# EAGLE design powerboard1_1 (EAGLE 8.1.0)
DRAWING_TITLE: POWER_BOARD; REVISION: 1.1
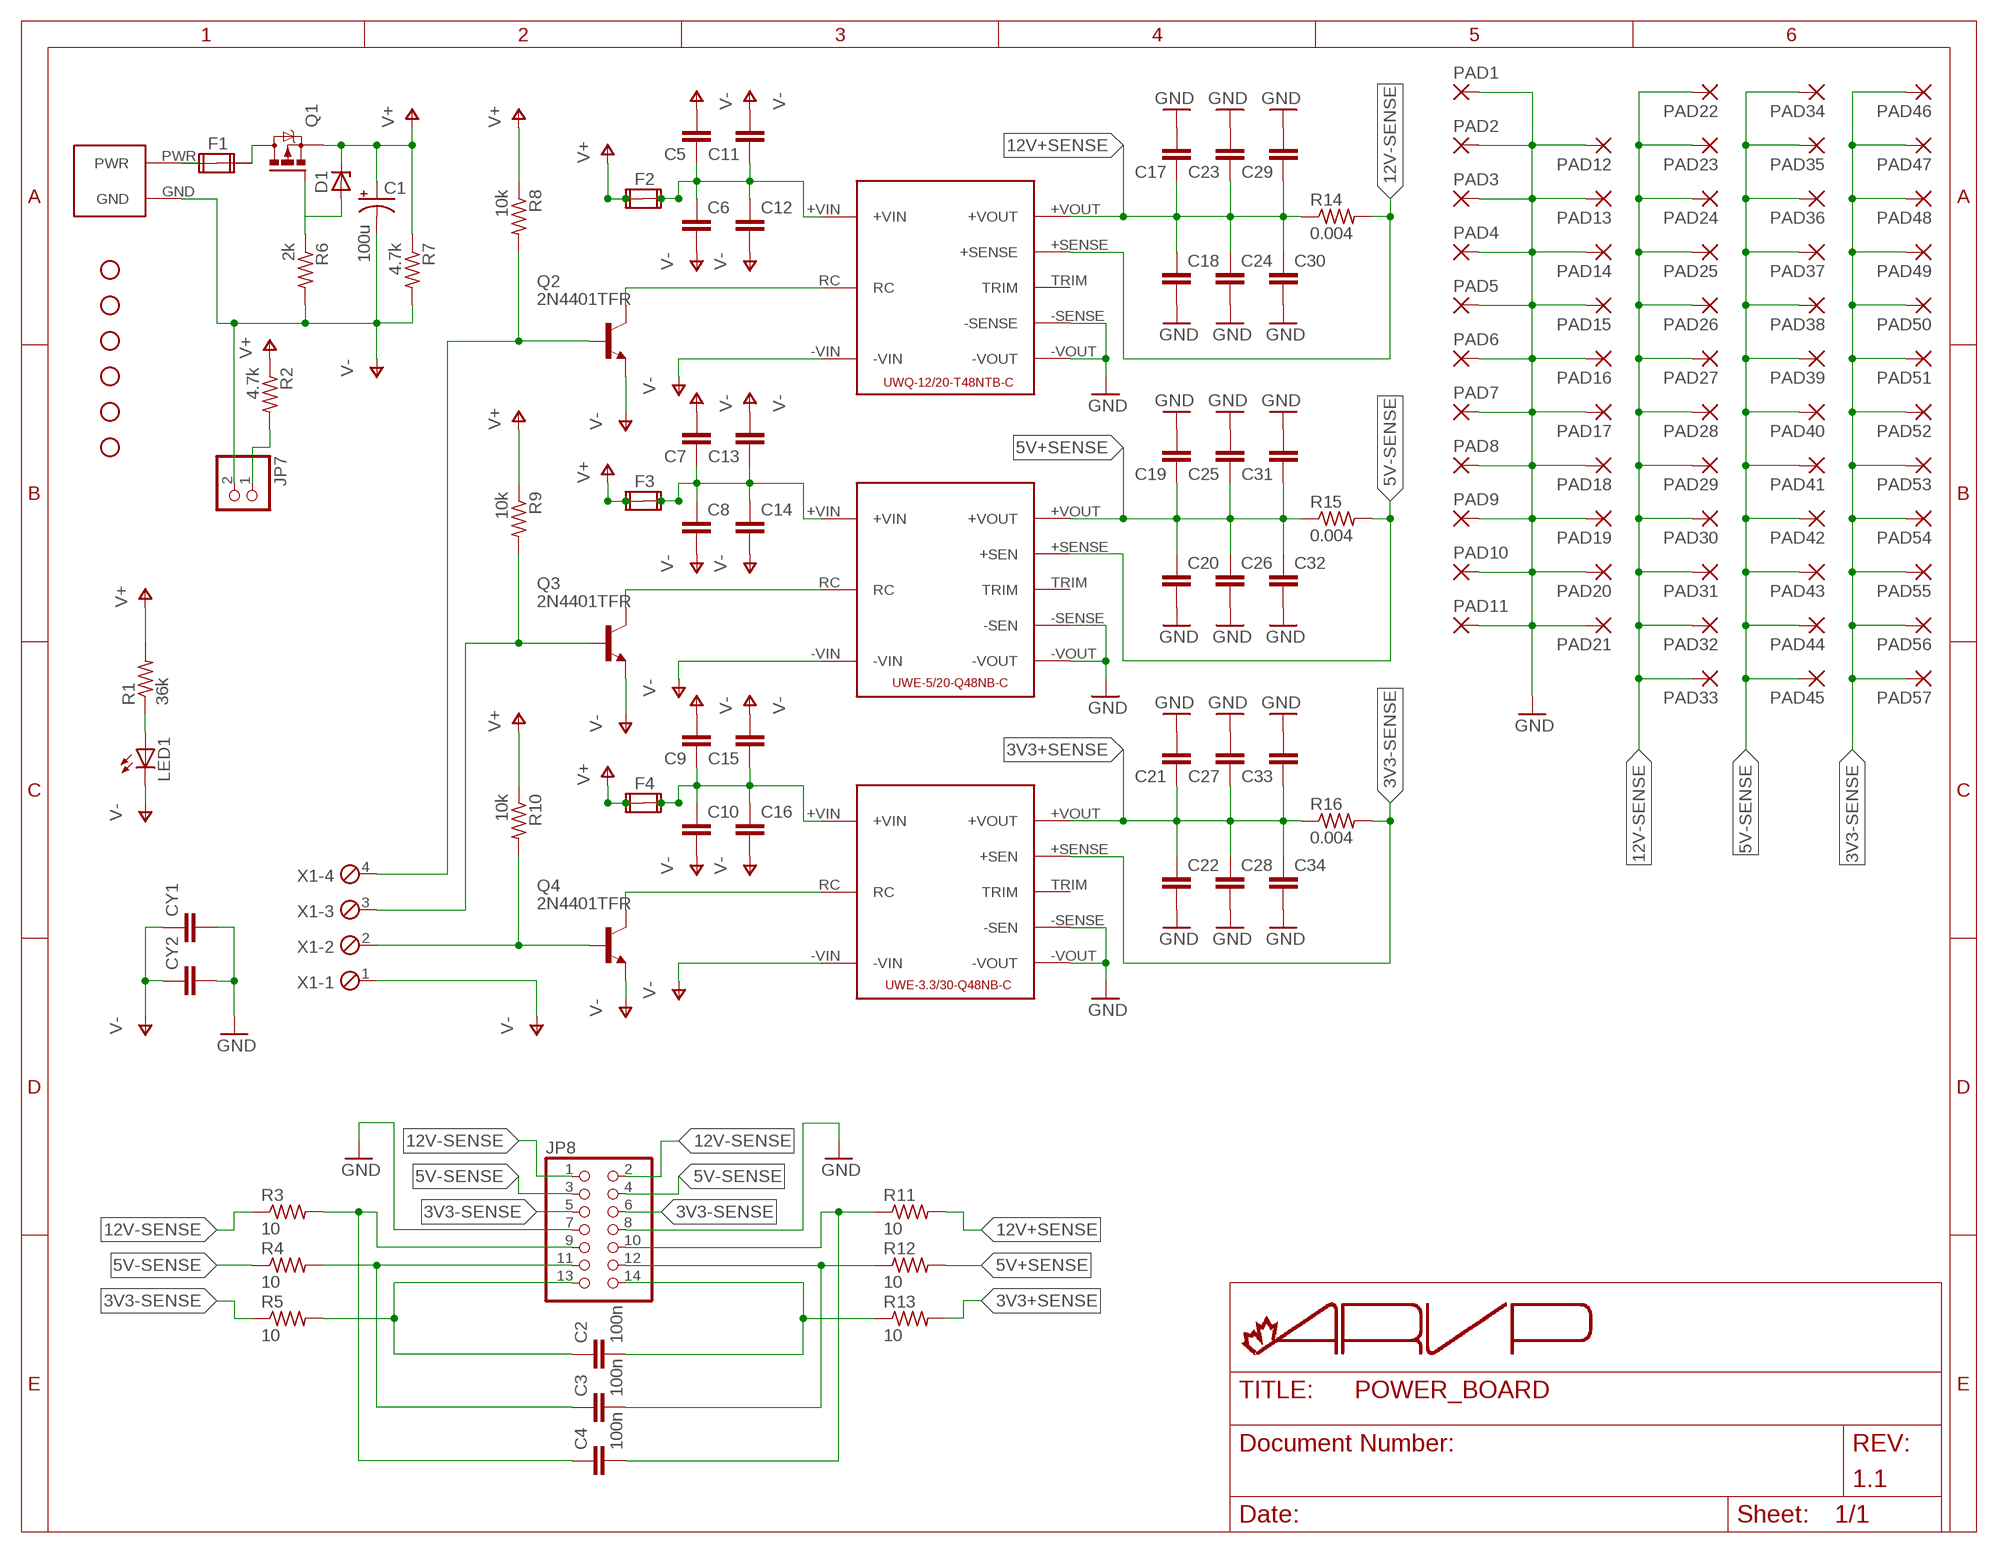
[diagram p0: schematic, sheet 1]

## Parts
C1  100u  CPOL-USE3.5-8  [E3,5-8]
C2  100n  C-EU025-024X044  [C025-024X044]
C3  100n  C-EU025-024X044  [C025-024X044]
C4  100n  C-EU025-024X044  [C025-024X044]
C5  C-EU050-035X075  [C050-035X075]
C6  C-EU050-035X075  [C050-035X075]
C7  C-EU050-035X075  [C050-035X075]
C8  C-EU050-035X075  [C050-035X075]
C9  C-EU050-035X075  [C050-035X075]
C10  C-EU050-035X075  [C050-035X075]
C11  C-EU050-035X075  [C050-035X075]
C12  C-EU050-035X075  [C050-035X075]
C13  C-EU050-035X075  [C050-035X075]
C14  C-EU050-035X075  [C050-035X075]
C15  C-EU050-035X075  [C050-035X075]
C16  C-EU050-035X075  [C050-035X075]
C17  C-EU025-040X050  [C025-040X050]
C18  C-EU025-040X050  [C025-040X050]
C19  C-EU025-040X050  [C025-040X050]
C20  C-EU025-040X050  [C025-040X050]
C21  C-EU025-040X050  [C025-040X050]
C22  C-EU025-040X050  [C025-040X050]
C23  C-EU025-040X050  [C025-040X050]
C24  C-EU025-040X050  [C025-040X050]
C25  C-EU025-040X050  [C025-040X050]
C26  C-EU025-040X050  [C025-040X050]
C27  C-EU025-040X050  [C025-040X050]
C28  C-EU025-040X050  [C025-040X050]
C29  C-EU025-040X050  [C025-040X050]
C30  C-EU025-040X050  [C025-040X050]
C31  C-EU025-040X050  [C025-040X050]
C32  C-EU025-040X050  [C025-040X050]
C33  C-EU025-040X050  [C025-040X050]
C34  C-EU025-040X050  [C025-040X050]
CY1  CYYC7B5  [YC7B5]
CY2  CYYC7B5  [YC7B5]
D1  BZV10  [DO34Z7]
F1  FUSE2P  [FUSE1]
F2  FUSE2P  [FUSE1]
F3  FUSE2P  [FUSE1]
F4  FUSE2P  [FUSE1]
JP1  STAND-OFF  [STAND-OFF]
JP2  STAND-OFF  [STAND-OFF]
JP3  STAND-OFF  [STAND-OFF]
JP4  STAND-OFF  [STAND-OFF]
JP5  STAND-OFF  [STAND-OFF]
JP6  STAND-OFF  [STAND-OFF]
JP7  PINHD-1X2  [1X02]
JP8  PINHD-2X7  [2X07]
LED1  LED3MM  [LED3MM]
P$1  AND_PWR  [AND_PWR]
PAD1  WIREPAD3,17/1,3  [3,17/1,3]
PAD2  WIREPAD3,17/1,3  [3,17/1,3]
PAD3  WIREPAD3,17/1,3  [3,17/1,3]
PAD4  WIREPAD3,17/1,3  [3,17/1,3]
PAD5  WIREPAD3,17/1,3  [3,17/1,3]
PAD6  WIREPAD3,17/1,3  [3,17/1,3]
PAD7  WIREPAD3,17/1,3  [3,17/1,3]
PAD8  WIREPAD3,17/1,3  [3,17/1,3]
PAD9  WIREPAD3,17/1,3  [3,17/1,3]
PAD10  WIREPAD3,17/1,3  [3,17/1,3]
PAD11  WIREPAD3,17/1,3  [3,17/1,3]
PAD12  WIREPAD3,17/1,3  [3,17/1,3]
PAD13  WIREPAD3,17/1,3  [3,17/1,3]
PAD14  WIREPAD3,17/1,3  [3,17/1,3]
PAD15  WIREPAD3,17/1,3  [3,17/1,3]
PAD16  WIREPAD3,17/1,3  [3,17/1,3]
PAD17  WIREPAD3,17/1,3  [3,17/1,3]
PAD18  WIREPAD3,17/1,3  [3,17/1,3]
PAD19  WIREPAD3,17/1,3  [3,17/1,3]
PAD20  WIREPAD3,17/1,3  [3,17/1,3]
PAD21  WIREPAD3,17/1,3  [3,17/1,3]
PAD22  WIREPAD3,17/1,3  [3,17/1,3]
PAD23  WIREPAD3,17/1,3  [3,17/1,3]
PAD24  WIREPAD3,17/1,3  [3,17/1,3]
PAD25  WIREPAD3,17/1,3  [3,17/1,3]
PAD26  WIREPAD3,17/1,3  [3,17/1,3]
PAD27  WIREPAD3,17/1,3  [3,17/1,3]
PAD28  WIREPAD3,17/1,3  [3,17/1,3]
PAD29  WIREPAD3,17/1,3  [3,17/1,3]
PAD30  WIREPAD3,17/1,3  [3,17/1,3]
PAD31  WIREPAD3,17/1,3  [3,17/1,3]
PAD32  WIREPAD3,17/1,3  [3,17/1,3]
PAD33  WIREPAD3,17/1,3  [3,17/1,3]
PAD34  WIREPAD3,17/1,3  [3,17/1,3]
PAD35  WIREPAD3,17/1,3  [3,17/1,3]
PAD36  WIREPAD3,17/1,3  [3,17/1,3]
PAD37  WIREPAD3,17/1,3  [3,17/1,3]
PAD38  WIREPAD3,17/1,3  [3,17/1,3]
PAD39  WIREPAD3,17/1,3  [3,17/1,3]
PAD40  WIREPAD3,17/1,3  [3,17/1,3]
PAD41  WIREPAD3,17/1,3  [3,17/1,3]
PAD42  WIREPAD3,17/1,3  [3,17/1,3]
PAD43  WIREPAD3,17/1,3  [3,17/1,3]
PAD44  WIREPAD3,17/1,3  [3,17/1,3]
PAD45  WIREPAD3,17/1,3  [3,17/1,3]
PAD46  WIREPAD3,17/1,3  [3,17/1,3]
PAD47  WIREPAD3,17/1,3  [3,17/1,3]
PAD48  WIREPAD3,17/1,3  [3,17/1,3]
PAD49  WIREPAD3,17/1,3  [3,17/1,3]
PAD50  WIREPAD3,17/1,3  [3,17/1,3]
PAD51  WIREPAD3,17/1,3  [3,17/1,3]
PAD52  WIREPAD3,17/1,3  [3,17/1,3]
PAD53  WIREPAD3,17/1,3  [3,17/1,3]
PAD54  WIREPAD3,17/1,3  [3,17/1,3]
PAD55  WIREPAD3,17/1,3  [3,17/1,3]
PAD56  WIREPAD3,17/1,3  [3,17/1,3]
PAD57  WIREPAD3,17/1,3  [3,17/1,3]
Q1  IPP80P03P4L04AKSA1  [TO220BV]
Q2  2N4401TFR  [TO92-EBC]
Q3  2N4401TFR  [TO92-EBC]
Q4  2N4401TFR  [TO92-EBC]
R1  36k  R-US_0204/7  [0204/7]
R2  4.7k  R-US_0204/7  [0204/7]
R3  10  R-US_0204/5  [0204/5]
R4  10  R-US_0204/5  [0204/5]
R5  10  R-US_0204/5  [0204/5]
R6  2k  R-US_0204/7  [0204/7]
R7  4.7k  R-US_0204/7  [0204/7]
R8  10k  R-US_0204/7  [0204/7]
R9  10k  R-US_0204/7  [0204/7]
R10  10k  R-US_0204/7  [0204/7]
R11  10  R-US_0204/5  [0204/5]
R12  10  R-US_0204/5  [0204/5]
R13  10  R-US_0204/5  [0204/5]
R14  0.004  R-US_0617/22  [0617/22]
R15  0.004  R-US_0617/22  [0617/22]
R16  0.004  R-US_0617/22  [0617/22]
U1  UWQ-12/20-T48NTB-C  [UWQ-12/20-T48]
U2  UWE-5/20-Q48NB-C  [UWE-100-120W]
U3  UWE-3.3/30-Q48NB-C  [UWE-100-120W]
X1  MPT4  [4POL254]

## Nets
3V3+SENSE: C21.1 C22.1 C27.1 C28.1 C33.1 C34.1 R13.2 R16.1 U3.+VOUT
3V3-SENSE: JP8.5 JP8.6 PAD46.1(P) PAD47.1(P) PAD48.1(P) PAD49.1(P) PAD50.1(P) PAD51.1(P) PAD52.1(P) PAD53.1(P) PAD54.1(P) PAD55.1(P) PAD56.1(P) PAD57.1(P) R5.1 R16.2 U3.+SENSE(+SEN)
5V+SENSE: C19.1 C20.1 C25.1 C26.1 C31.1 C32.1 R12.2 R15.1 U2.+VOUT
5V-SENSE: JP8.3 JP8.4 PAD34.1(P) PAD35.1(P) PAD36.1(P) PAD37.1(P) PAD38.1(P) PAD39.1(P) PAD40.1(P) PAD41.1(P) PAD42.1(P) PAD43.1(P) PAD44.1(P) PAD45.1(P) R4.1 R15.2 U2.+SENSE(+SEN)
12V+SENSE: C17.1 C18.1 C23.1 C24.1 C29.1 C30.1 R11.2 R14.1 U1.+VOUT
12V-SENSE: JP8.1 JP8.2 PAD22.1(P) PAD23.1(P) PAD24.1(P) PAD25.1(P) PAD26.1(P) PAD27.1(P) PAD28.1(P) PAD29.1(P) PAD30.1(P) PAD31.1(P) PAD32.1(P) PAD33.1(P) R3.1 R14.2 U1.+SENSE
GND [ouputGroundPlane]: C17.2 C18.2 C19.2 C20.2 C21.2 C22.2 C23.2 C24.2 C25.2 C26.2 C27.2 C28.2 C29.2 C30.2 C31.2 C32.2 C33.2 C34.2 CY1.2 CY2.2 JP8.7 JP8.8 PAD1.1(P) PAD2.1(P) PAD3.1(P) PAD4.1(P) PAD5.1(P) PAD6.1(P) PAD7.1(P) PAD8.1(P) PAD9.1(P) PAD10.1(P) PAD11.1(P) PAD12.1(P) PAD13.1(P) PAD14.1(P) PAD15.1(P) PAD16.1(P) PAD17.1(P) PAD18.1(P) PAD19.1(P) PAD20.1(P) PAD21.1(P) U1.-SENSE U1.-VOUT U2.-SENSE(-SEN) U2.-VOUT U3.-SENSE(-SEN) U3.-VOUT
J3: C4.1 JP8.9 R3.2
J4: C4.2 JP8.10 R11.1
J5: C3.1 JP8.11 R4.2
J6: C3.2 JP8.12 R12.1
J7: C2.1 JP8.13 R5.2
J8: C2.2 JP8.14 R13.1
N$1: LED1.A R1.1
N$2: JP7.1 R2.2
N$3: F1.1A F1.1B P$1.PWR
N$4: D1.A Q1.G R6.1
N$5: C5.1 C6.1 C11.1 C12.1 F2.2A F2.2B U1.+VIN
N$7: C7.1 C8.1 C13.1 C14.1 F3.2A F3.2B U2.+VIN
N$8: Q2.C U1.RC
N$10: Q3.C U2.RC
N$11: Q4.C U3.RC
N$12: C9.1 C10.1 C15.1 C16.1 F4.2A F4.2B U3.+VIN
ON/OFF_1 [inputGroundPlane]: Q2.B R8.2 X1.4
ON/OFF_2 [inputGroundPlane]: Q3.B R9.2 X1.3
ON/OFF_3 [inputGroundPlane]: Q4.B R10.2 X1.2
V+: C1.+ D1.C F2.1A F2.1B F3.1A F3.1B F4.1A F4.1B Q1.S R1.2 R2.1 R7.1 R8.1 R9.1 R10.1
V- [ouputGroundPlane]: C1.- C5.2 C6.2 C7.2 C8.2 C9.2 C10.2 C11.2 C12.2 C13.2 C14.2 C15.2 C16.2 CY1.1 CY2.1 JP7.2 LED1.K(C) P$1.GND Q2.E Q3.E Q4.E R6.2 R7.2 U1.-VIN U2.-VIN U3.-VIN X1.1
VBAT+: F1.2A F1.2B Q1.D
Unconnected: U1.TRIM U2.TRIM U3.TRIM

## Library data of the parts
C1 = rcl:CPOL-US: POLARIZED CAPACITOR, American symbol
C2-C34 = rcl:C-EU: CAPACITOR, European symbol
CY1 CY2 = rcl:CY: Y CAPACITOR for power line
D1 = diode:BZV10: Z DIODE
F1-F4 = special:FUSE2P: FUSE 5 x 20 mm
JP1-JP6 = SparkFun:STAND-OFF: Stand Off This is the mechanical footprint for a #4 phillips button head screw. Use the keepout ring to avoid running the screw head into surrounding components. SKU : PRT-00447
JP7 = pinhead:PINHD-1X2: PIN HEADER
JP8 = pinhead:PINHD-2X7: PIN HEADER
LED1 = led:LED: LED OSRAM: - CHIPLED LG R971, LG N971, LY N971, LG Q971, LY Q971, LO R971, LY R971 LH N974, LH R974 LS Q976, LO Q976, LY Q976 LO Q996 - Hyper CHIPLED LW Q18S LB Q993, LB Q99A, LB R99A - SideLED LS A670, LO A670, LY A670, LG A670, LP A670 LB A673, LV A673, LT A673, LW A673 LH A674 LY A675 LS A676, LA A676, LO A676, LY A676, LW A676 LS A679, LY A679, LG A679 - Hyper Micro SIDELED® LS Y876, LA Y876, LO Y876, LY Y876 LT Y87S - SmartLED LW L88C, LW L88S LB L89C, LB L89S, LG L890 LS L89K, LO L89K, LY L89K LS L896, LA L896, LO L896, LY L896 - TOPLED LS T670, LO T670, LY T670, LG T670, LP T670 LSG T670, LSP T670, LSY T670, LOP T670, LYG T670 LG T671, LOG T671, LSG T671 LB T673, LV T673, LT T673, LW T673 LH T674 LS T676, LA T676, LO T676, LY T676, LB T676, LH T676, LSB T676, LW T676 LB T67C, LV T67C, LT T67C, LS T67K, LO T67K, LY T67K, LW E67C LS E67B, LA E67B, LO E67B, LY E67B, LB E67C, LV E67C, LT E67C LW T67C LS T679, LY T679, LG T679 LS T770, LO T770, LY T770, LG T770, LP T770 LB T773, LV T773, LT T773, LW T773 LH T774 LS E675, LA E675, LY E675, LS T675 LS T776, LA T776, LO T776, LY T776, LB T776 LHGB T686 LT T68C, LB T68C - Hyper Mini TOPLED® LB M676 - Mini TOPLED Santana® LG M470 LS M47K, LO M47K, LY M47K Source: http://www.osram.convergy.de LUXEON: - LUMILED® LXK2-PW12-R00, LXK2-PW12-S00, LXK2-PW14-U00, LXK2-PW14-V00 LXK2-PM12-R00, LXK2-PM12-S00, LXK2-PM14-U00 LXK2-PE12-Q00, LXK2-PE12-R00, LXK2-PE12-S00, LXK2-PE14-T00, LXK2-PE14-U00 LXK2-PB12-K00, LXK2-PB12-L00, LXK2-PB12-M00, LXK2-PB14-N00, LXK2-PB14-P00, LXK2-PB14-Q00 LXK2-PR12-L00, LXK2-PR12-M00, LXK2-PR14-Q00, LXK2-PR14-R00 LXK2-PD12-Q00, LXK2-PD12-R00, LXK2-PD12-S00 LXK2-PH12-R00, LXK2-PH12-S00 LXK2-PL12-P00, LXK2-PL12-Q00, LXK2-PL12-R00 Source: www.luxeon.com KINGBRIGHT: KA-3528ASYC Source: www.kingbright.com
P$1 = ARVP:AND_PWR
PAD1-PAD57 = wirepad:WIREPAD: Wire PAD connect wire on PCB
Q1 = transistor-power:IPP80P03P4L04AKSA1: P-CHANNEL MOS-FET SYMBOL
Q2-Q4 = New Power Board Library:2N4401TFR: NPN Transistor
R1 R2 R6-R10 = resistor:R-US_: RESISTOR, American symbol
R3-R5 R11-R16 = rcl:R-US_: RESISTOR, American symbol
U1 = New Power Board Library:UWQ-12/20-T48NTB-C
U2 = New Power Board Library:UWE-5/20-Q48NB-C
U3 = New Power Board Library:UWE-3.3/30-Q48NB-C
X1 = con-phoenix-254:MPT4: PHOENIX CONNECTOR; OC_FARNELL: unknown; OC_NEWARK: unknown

## Net classes
0 default: clearance 0.205 mm
1 ouputGroundPlane: clearance 0.205 mm to class 0, clearance 1 mm
2 inputGroundPlane: clearance 0.205 mm to class 1

## Board
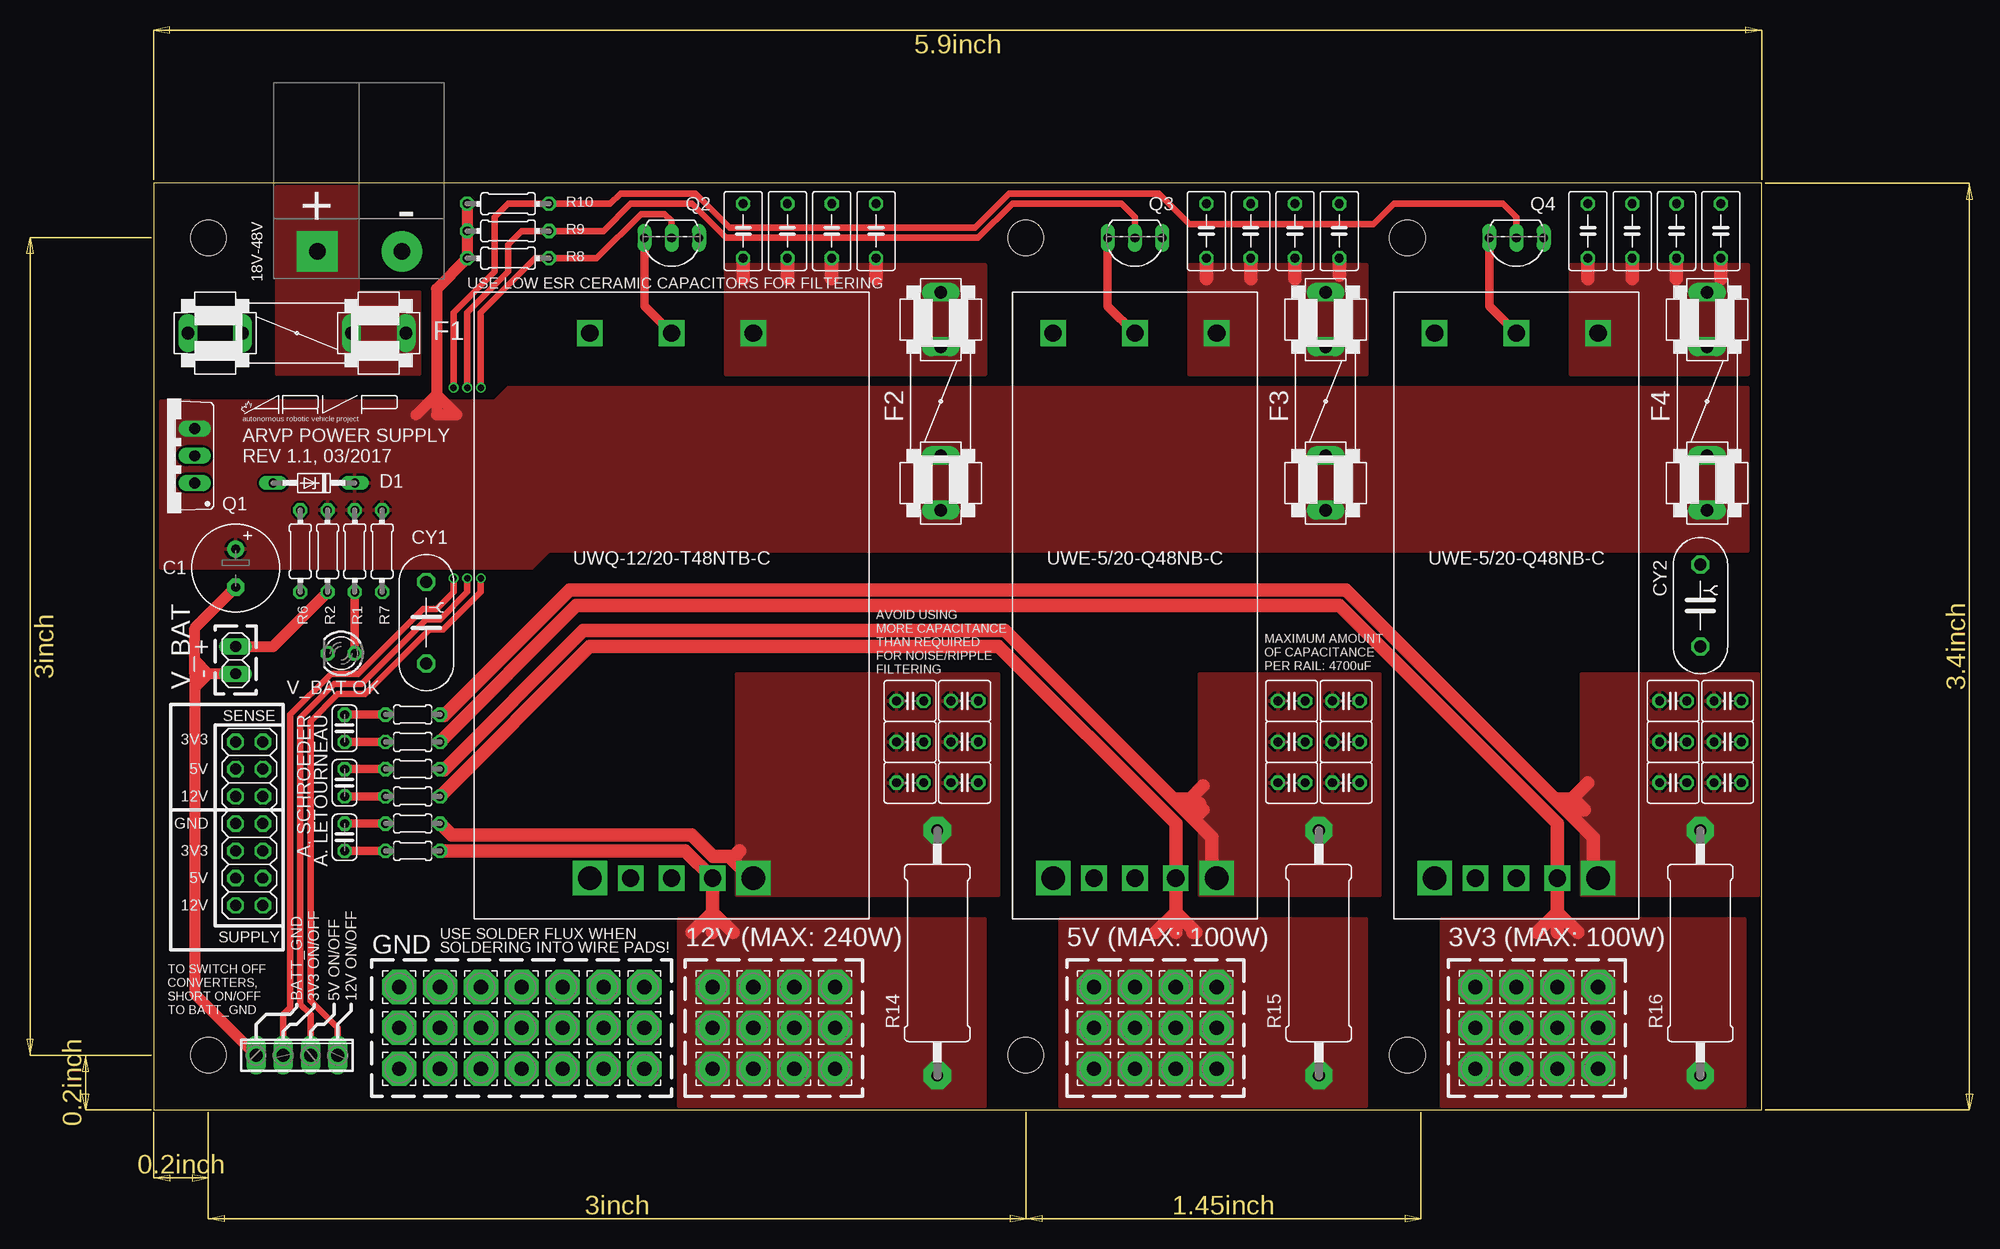
[diagram p1: board, top side]
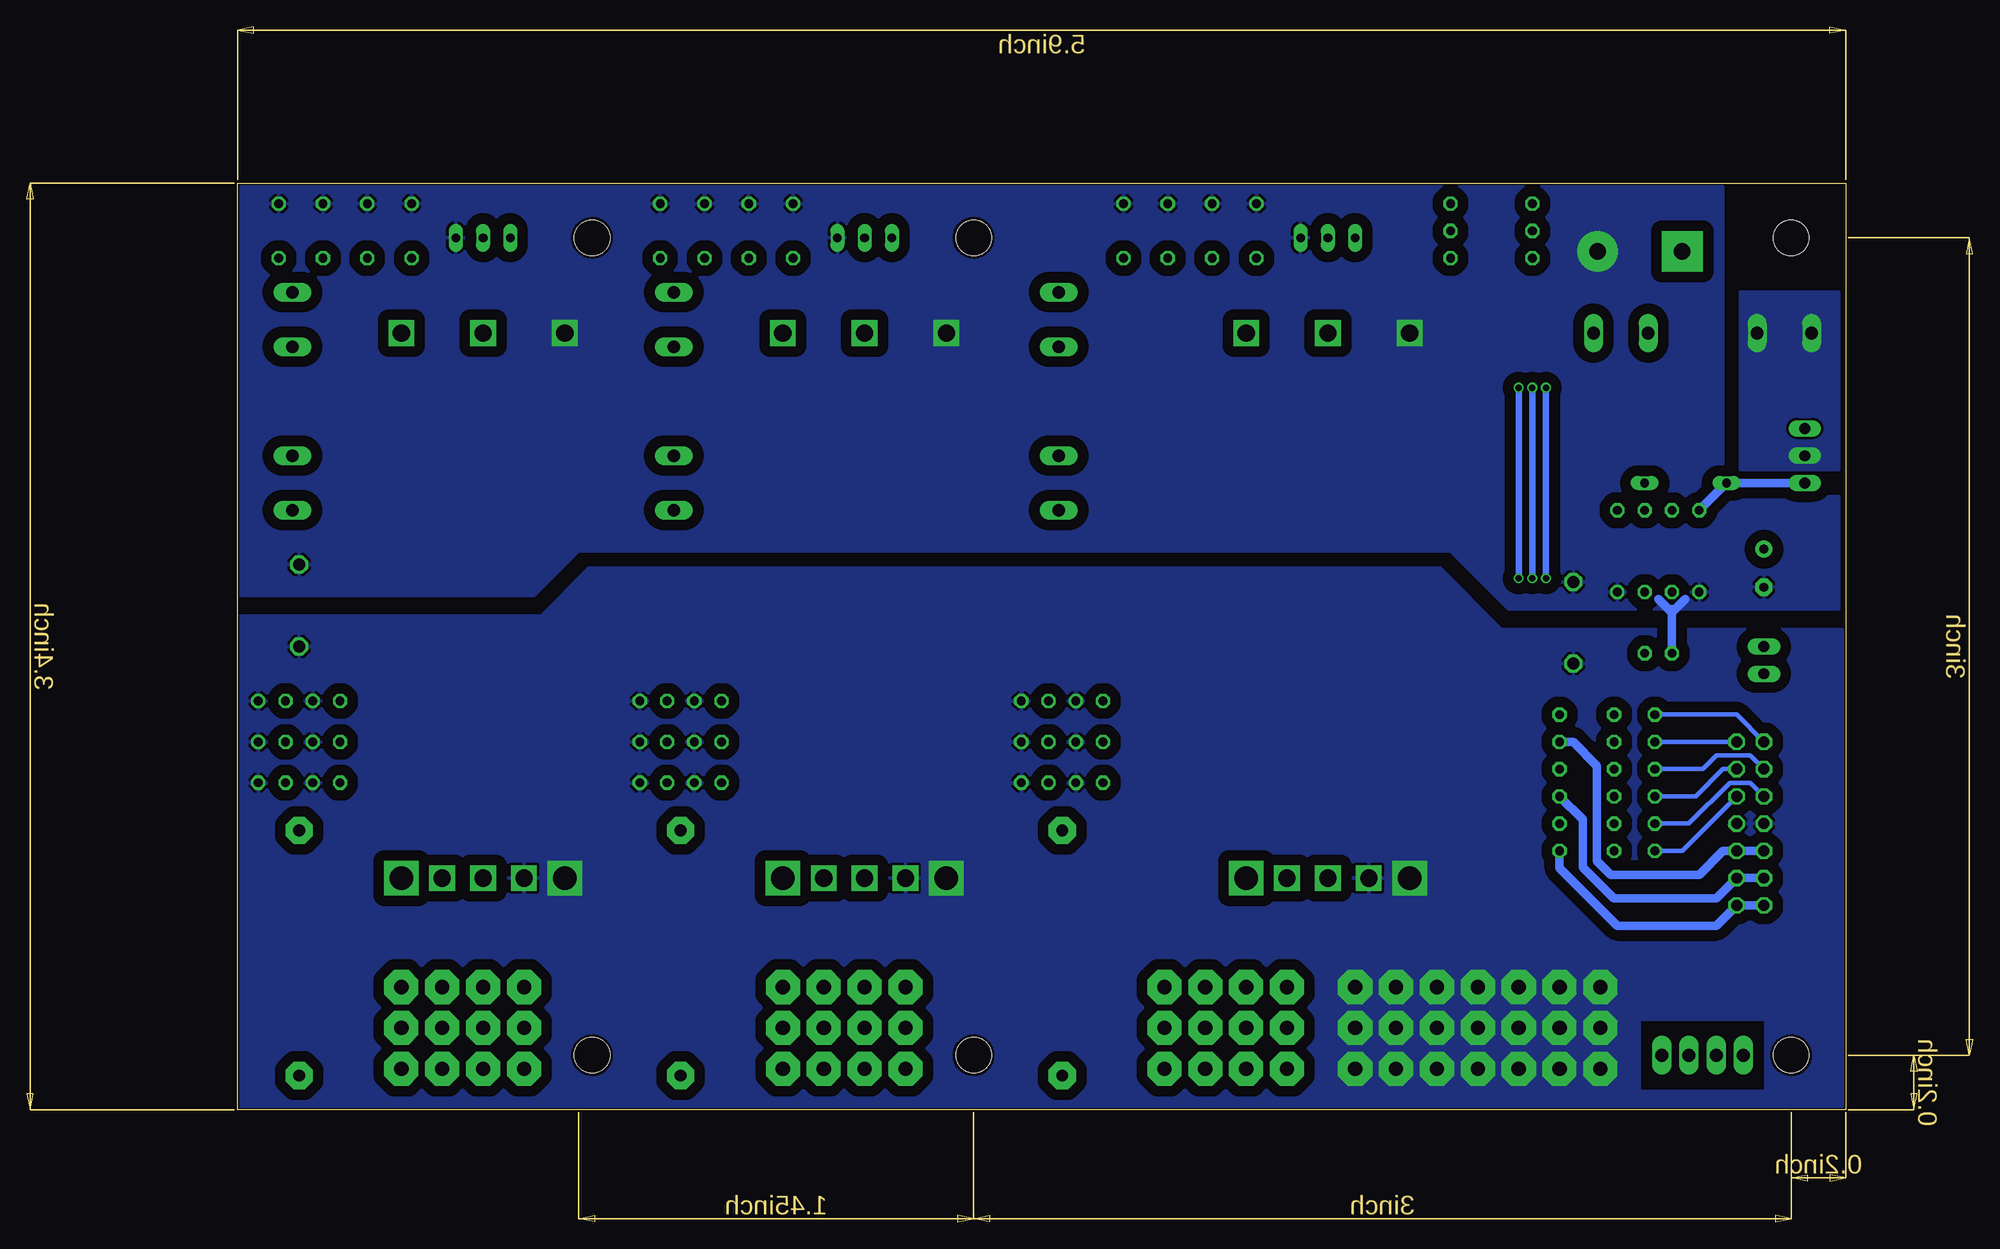
[diagram p2: board, bottom side, seen from below]

Size 181.36 x 111.41 mm. Coordinates in mm from the lower left corner, seen from the top.
Copper layers (1*16): Top 0.035mm / dielectric 1.5mm / Bottom 0.035mm
Design rules "ITEADstudioDRC": minimum track width 6mil, minimum drill 12mil, track to track 6mil, track to pad 6mil, pad to pad 6mil, via to via 6mil, smd to smd 0mil, copper to edge 10mil, drill to drill 10mil, minimum pad ring 10mil, minimum via ring 6mil, stop-mask expansion 2mil, vias tented up to drill 100mil, thermal gap 10mil
Milling: 4 lines

### Footprints (pad centres in the part's own frame; a part is rotated, then mirrored left to right if it is on the bottom)
E3,5-8 = drill 0.813 pad 1.6: + -1.778,0 | drill 0.813 pad 1.6 octagon: - 1.778,0
C025-024X044 = drill 0.813 octagon: 1 -1.27,0; 2 1.27,0
C050-035X075 = drill 0.813 octagon: 1 -2.54,0; 2 2.54,0
C025-040X050 = drill 0.813 octagon: 1 -1.27,0; 2 1.27,0
YC7B5 = drill 1.118 octagon: 1 -3.81,0; 2 3.81,0
DO34Z7 = drill 0.813 long: A 3.81,0; C -3.81,0
FUSE1 = drill 1.194 long: 1A -10.16,0; 1B -5.08,0; 2A 10.16,0; 2B 5.08,0
STAND-OFF = hole 3.302: 0,0
1X02 = drill 1.016 long: 1 -1.27,0; 2 1.27,0
2X07 = drill 1.016 octagon: 1 -7.62,-1.27; 2 -7.62,1.27; 3 -5.08,-1.27; 4 -5.08,1.27; 5 -2.54,-1.27; 6 -2.54,1.27; 7 0,-1.27; 8 0,1.27; 9 2.54,-1.27; 10 2.54,1.27; 11 5.08,-1.27; 12 5.08,1.27; 13 7.62,-1.27; 14 7.62,1.27
LED3MM = drill 0.813 octagon: A -1.27,0; K 1.27,0
AND_PWR = drill 1.524 pad 3.81: GND 0,-7.886 | drill 1.524 pad 3.81 square: PWR 0,0
3,17/1,3 = drill 1.321 pad 3.175 octagon: 1 0,0
TO220BV = drill 1.016 long: D 0,-2.54; G -2.54,-2.54; S 2.54,-2.54
TO92-EBC = drill 0.813 long: B 0,-1.27; C 2.54,-1.27; E -2.54,-1.27
0204/7 = drill 0.813 octagon: 1 -3.81,0; 2 3.81,0
0204/5 = drill 0.813 octagon: 1 -2.54,0; 2 2.54,0
0617/22 = drill 1.1 pad 2.54 octagon: 1 -11.43,0; 2 11.43,0
UWQ-12/20-T48 = drill 1.6 square: +SENSE 25.4,3.81; +VIN -25.4,7.62; -SENSE 25.4,-3.81; -VIN -25.4,-7.62; RC -25.4,0; TRIM 25.4,0 | drill 2.2 square: +VOUT 25.4,7.62; -VOUT 25.4,-7.62
UWE-100-120W = drill 1.6 square: +SENSE 25.4,3.81; +VIN -25.4,7.62; -SENSE 25.4,-3.81; -VIN -25.4,-7.62; RC -25.4,0; TRIM 25.4,0 | drill 2.2 square: +VOUT 25.4,7.62; -VOUT 25.4,-7.62
4POL254 = drill 1.2 long: 1 -3.81,0; 2 -1.27,0; 3 1.27,0; 4 3.81,0

### Placement (x,y rotation side)
C1  19.46,60.94 270 top
C2  29.62,46.02 90 top
C3  29.62,40.94 90 top
C4  29.62,35.86 90 top
C5  79.15,92.38 90 top
C6  66.76,92.38 90 top
C7  122.33,92.38 90 top
C8  109.94,92.38 90 top
C9  157.89,92.38 90 top
C10  145.5,92.38 90 top
C11  75.02,92.38 90 top
C12  70.89,92.38 90 top
C13  118.2,92.38 90 top
C14  114.07,92.38 90 top
C15  153.76,92.38 90 top
C16  149.63,92.38 90 top
C17  87.4,40.94 0 top
C18  82.32,48.56 0 top
C19  122.96,40.94 0 top
C20  117.88,44.75 0 top
C21  158.52,40.94 0 top
C22  153.44,48.56 0 top
C23  87.4,44.75 0 top
C24  82.32,44.75 0 top
C25  122.96,44.75 0 top
C26  117.88,48.56 0 top
C27  158.52,44.75 0 top
C28  153.44,44.75 0 top
C29  87.4,48.56 0 top
C30  82.32,40.94 0 top
C31  122.96,48.56 0 top
C32  117.88,40.94 0 top
C33  158.52,48.56 0 top
C34  153.44,40.94 0 top
CY1  37.24,55.86 270 top
CY2  155.98,57.45 270 top
D1  26.76,68.88 180 top
F1  25.17,82.85 180 top
F2  85.18,76.5 90 top
F3  121.06,76.5 90 top
F4  156.62,76.5 90 top
JP1  93.12,15.54 0 top
JP2  128.68,15.54 0 top
JP3  128.68,91.74 0 top
JP4  16.92,15.54 0 top
JP5  16.92,91.74 0 top
JP6  93.12,91.74 0 top
JP7  19.46,52.37 270 top
JP8  20.73,37.13 90 top
LED1  29.3,53.01 180 top
P$1  27.08,90.47 90 top
PAD1  38.51,21.89 0 top
PAD2  42.32,21.89 0 top
PAD3  46.13,21.89 0 top
PAD4  49.94,21.89 0 top
PAD5  53.75,21.89 0 top
PAD6  57.56,21.89 0 top
PAD7  34.7,14.27 0 top
PAD8  38.51,18.08 0 top
PAD9  42.32,18.08 0 top
PAD10  46.13,18.08 0 top
PAD11  49.94,18.08 0 top
PAD12  34.7,18.08 0 top
PAD13  57.56,14.27 0 top
PAD14  53.75,14.27 0 top
PAD15  49.94,14.27 0 top
PAD16  46.13,14.27 0 top
PAD17  42.32,14.27 0 top
PAD18  38.51,14.27 0 top
PAD19  34.7,21.89 0 top
PAD20  57.56,18.08 0 top
PAD21  53.75,18.08 0 top
PAD22  71.53,21.89 0 top
PAD23  75.34,21.89 0 top
PAD24  75.34,14.27 0 top
PAD25  71.53,14.27 0 top
PAD26  67.72,14.27 0 top
PAD27  63.91,14.27 0 top
PAD28  75.34,18.08 0 top
PAD29  63.91,21.89 0 top
PAD30  67.72,21.89 0 top
PAD31  71.53,18.08 0 top
PAD32  67.72,18.08 0 top
PAD33  63.91,18.08 0 top
PAD34  110.9,14.27 0 top
PAD35  110.9,21.89 0 top
PAD36  107.09,21.89 0 top
PAD37  107.09,14.27 0 top
PAD38  103.28,14.27 0 top
PAD39  99.47,14.27 0 top
PAD40  110.9,18.08 0 top
PAD41  99.47,21.89 0 top
PAD42  103.28,21.89 0 top
PAD43  107.09,18.08 0 top
PAD44  103.28,18.08 0 top
PAD45  99.47,18.08 0 top
PAD46  146.46,21.89 0 top
PAD47  142.65,21.89 0 top
PAD48  146.46,14.27 0 top
PAD49  142.65,14.27 0 top
PAD50  138.84,14.27 0 top
PAD51  135.03,14.27 0 top
PAD52  138.84,21.89 0 top
PAD53  135.03,21.89 0 top
PAD54  146.46,18.08 0 top
PAD55  142.65,18.08 0 top
PAD56  138.84,18.08 0 top
PAD57  135.03,18.08 0 top
Q1  13.11,71.42 90 top
Q2  60.1,90.47 180 top
Q3  103.28,90.47 180 top
Q4  138.84,90.47 180 top
R1  30.57,62.53 90 top
R2  28.03,62.53 270 top
R3  35.97,34.59 180 top
R4  35.97,39.67 180 top
R5  35.97,44.75 180 top
R6  25.49,62.53 270 top
R7  33.11,62.53 270 top
R8  44.86,89.84 0 top
R9  44.86,92.38 0 top
R10  44.86,94.91 0 top
R11  35.97,37.13 0 top
R12  35.97,42.21 0 top
R13  35.97,47.29 0 top
R14  84.86,25.07 270 top
R15  120.42,25.07 270 top
R16  155.98,25.07 270 top
U1  60.1,57.45 270 top
U2  103.28,57.45 270 top
U3  138.84,57.45 270 top
U$1  [FRAME_A_L]  -55.47,-61.93 0 top  (outside the outline)
U$2  [DOCFIELD]  118.52,-61.93 0 top  (outside the outline)
U$3  [ARVP]  20.09,74.59 0 top
X1  25.17,15.54 0 top

### Tracks (layer width: path | path; a pad name or v marks a point on that pad's centre or on a via)
3V3+SENSE
  Top 1.27: U3.+VOUT 146.03,32.48 146.03,35.84 122.94,58.93 50.6,58.93 38.89,47.22 38.58,47.22 R13.2 | 145.5,40.94 144.01,39.44 142.42,39.44 144.14,39.44 145.19,38.4
  pour Top: 161.38,30.46 161.38,51.1 144.87,51.1 144.87,30.46
  pour Top (no thermals): 157.89,38.4 144.87,38.4 144.87,30.46 157.89,30.46
3V3-SENSE
  Top 1.27: 142.65,26.97 U3.+SENSE 142.65,37.13 122.33,57.45 51.21,57.45 R5.1 | 142.65,28.88 142.65,29.51 142.65,28.88 | 142.65,28.88 140.74,26.97 | 142.65,28.88 144.55,26.97
  Bottom 0.813: JP8.6 JP8.5 23.27,34.59 25.49,32.37 33.74,32.37 35.02,33.64 35.02,42.53 37.24,44.75 R5.1
  pour Top (no thermals): 131.85,28.24 160.11,28.24 160.11,10.78 131.85,10.78
5V+SENSE
  Top 1.27: U2.+VOUT 110.47,32.48 110.47,35.84 91.19,55.12 51.87,55.12 38.89,42.14 38.58,42.14 R12.2 | 109.63,38.4 109.4,38.17 108.13,38.17 108.45,38.17 109.31,39.03 | 106.86,39.44 108.45,39.44 109.63,40.62
  pour Top: 109.31,30.46 109.31,51.1 126.14,51.1 126.14,30.46
  pour Top (no thermals): 122.33,38.4 109.31,38.4 109.31,30.46 122.33,30.46
5V-SENSE
  Top 1.27: 107.09,26.97 U2.+SENSE 107.09,37.13 90.58,53.64 52.48,53.64 R4.1 | 107.09,28.88 107.09,29.51 107.09,28.88 | 107.09,28.88 108.99,26.97 108.67,26.97 | 107.09,28.88 105.18,26.97
  Bottom 0.813: JP8.4 JP8.3 23.9,30.15 33.43,30.15 36.35,33.07 36.35,37.51 R4.1
  pour Top (no thermals): 124.87,28.24 96.29,28.24 96.29,10.78 124.87,10.78
12V+SENSE
  Top 1.27: 65.46,34.09 63.95,34.09 61.98,36.06 39.57,36.06 R11.2 | U1.+VOUT 67.5,32.05 65.46,34.09 | 65.46,34.09 65.95,34.09 66.45,34.59
  pour Top: 66.13,30.46 90.58,30.46 90.58,51.1 66.13,51.1
  pour Top (no thermals): 86.77,38.4 66.13,38.4 66.13,30.46 86.77,30.46
12V-SENSE
  Top 1.27: 63.91,26.97 U1.+SENSE 61.37,34.59 R3.1 | 63.91,28.88 65.81,26.97 | 63.91,29.51 63.91,28.88 | 63.91,28.88 62,26.97
  Bottom 0.813: JP8.2 JP8.1 23.9,27.61 33.11,27.61 38.51,33 R3.1
  pour Top (no thermals): 89.31,28.24 60.73,28.24 60.73,10.78 89.31,10.78
GND
  pour Bottom: 161.38,56.5 161.38,10.78 12.15,10.78 12.15,55.23 43.9,55.23 49.62,60.94 128.99,60.94 133.44,56.5
  pour Bottom (no thermals): 49.94,34.59 49.94,29.51 54.7,29.51 54.7,34.59
  pour Bottom (no thermals): 93.12,34.59 93.12,29.51 97.88,29.51 97.88,34.59
  pour Bottom (no thermals): 128.68,34.59 128.68,29.51 133.44,29.51 133.44,34.59
  pour Bottom (no thermals): 32.16,24.43 32.16,11.73 61.37,11.73 61.37,24.43
  cutout Bottom: 19.46,18.71 30.89,18.71 30.89,12.37 19.46,12.37
J3
  Top 0.813: R3.2 C4.1
  Bottom 0.406: JP8.9 27.08,34.59 C4.1
J4
  Top 0.813: R11.1 C4.2
  Bottom 0.406: JP8.10 20.73,40.94 22.63,40.94 26.44,37.13 C4.2
J5
  Top 0.813: R4.2 C3.1
  Bottom 0.406: JP8.11 23.27,42.21 25.81,39.67 C3.1
J6
  Top 0.813: R12.1 C3.2
  Bottom 0.406: JP8.12 20.73,43.48 23.9,43.48 25.17,42.21 C3.2
J7
  Top 0.813: R5.2 C2.1
  Bottom 0.406: JP8.13 C2.1
J8
  Top 0.813: R13.1 C2.2
  Bottom 0.406: JP8.14 22,47.29 C2.2
N$1
  Top 0.813: R1.1 LED1.A
N$2
  Top 1.016: JP7.1 22.95,53.64 R2.2
N$3
  pour Top (no thermals): 30.89,96.5 23.27,96.5 23.27,79.04 36.6,79.04 36.6,86.66 30.89,86.66
N$4
  Bottom 0.813: R6.1 D1.A Q1.G
N$5
  Top 1.27: C6.1 66.77,87.93 | C12.1 70.89,87.93 | C11.1 75.02,87.93 | C5.1 79.15,87.93
  pour Top (no thermals): 89.31,79.04 89.31,89.2 65.18,89.2 65.18,79.04
N$7
  Top 1.27: C8.1 109.94,87.93 | C14.1 114.07,87.93 | C13.1 118.2,87.93 | C7.1 122.33,88.25
  pour Top (no thermals): 124.87,89.2 108.36,89.2 108.36,79.04 124.87,79.04
N$8
  Top 0.813: Q2.C 57.56,85.39 U1.RC
N$10
  Top 0.813: Q3.C 100.74,85.39 U2.RC
N$11
  Top 0.813: Q4.C 136.3,85.39 U3.RC
N$12
  Top 1.27: C10.1 145.5,87.93 | C16.1 149.63,87.93 | C15.1 153.76,87.93 | C9.1 157.89,87.93
  pour Top (no thermals): 160.43,89.2 143.92,89.2 143.92,79.04 160.43,79.04
ON/OFF_1  (via drill 0.6)
  Top 0.61: X1.4 28.98,18.08 26.44,20.62 26.44,46.66 28.98,49.2 31.52,49.2 37.56,55.23 38.82,55.23 42.32,58.72 v42.32,59.99 | v42.32,77.77 42.32,84.75 47.4,89.84 R8.2 53.11,89.84 57.24,93.96 59.46,93.96 60.1,93.33 Q2.B
  Bottom 0.61: v42.32,59.99 v42.32,77.77
ON/OFF_2  (via drill 0.6)
  Top 0.61: v41.05,59.99 41.05,58.72 38.51,56.18 37.24,56.18 31.21,50.15 28.67,50.15 25.49,46.97 25.49,20.3 26.44,19.35 X1.3 | v41.05,77.77 41.05,84.75 44.86,88.56 44.86,91.1 46.13,92.38 R9.2 53.75,92.38 56.29,94.91 62,94.91 65.18,91.74 88.67,91.74 91.85,94.91 102.01,94.91 103.28,93.65 Q3.B
  Bottom 0.61: v41.05,77.77 v41.05,59.99
ON/OFF_3  (via drill 0.6)
  Top 0.61: v39.78,59.99 39.78,58.72 38.19,57.13 36.92,57.13 30.89,51.1 28.35,51.1 24.54,47.29 24.54,19.99 23.9,19.35 X1.2 | v39.78,77.77 39.78,84.75 43.59,88.56 43.59,93.65 44.86,94.91 R10.2 54.38,94.91 55.33,95.87 62.32,95.87 65.5,92.69 88.36,92.69 91.53,95.87 105.5,95.87 108.36,93.01 125.5,93.01 127.41,94.91 137.57,94.91 138.84,93.65 Q4.B
  Bottom 0.61: v39.78,77.77 v39.78,59.99
V+
  Top 1.016: R10.1 R9.1 R8.1 38.19,86.98 38.19,77.13 | 38.19,77.13 38.19,75.23 40.1,75.23 38.19,77.13 | 38.19,77.13 36.28,75.23
  pour Top: 160.43,62.53 48.67,62.53 47.08,60.94 12.47,60.94 12.47,76.5 43.59,76.5 44.86,77.77 160.43,77.77
  pour Top (no thermals): 81.69,72.69 81.69,62.53 160.43,62.53 160.43,72.69
  pour Top (no thermals): 12.47,76.5 12.47,70.15 23.27,70.15 23.27,76.5
V-
  Top 1.016: 16.92,51.1 15.65,49.83 | 15.65,49.83 15.65,21.26 X1.1 | 16.92,51.1 JP7.2 15.65,51.1 | 15.65,52.37 16.92,51.1 | 15.65,52.37 15.65,55.36 C1.- | 15.65,51.1 15.65,49.83 | 15.65,51.1 15.65,52.37
  Bottom 0.813: 28.03,56.82 LED1.K | 28.03,57.13 28.03,56.82 | 28.03,56.82 29.3,58.09 | 28.03,56.82 26.76,58.09
  pour Bottom: 23.27,96.5 161.38,96.5 161.38,58.4 134.07,58.4 129.95,62.53 48.67,62.53 43.27,57.13 12.47,57.13 12.47,67.61 23.27,67.61
  pour Bottom (no thermals): 128.68,85.39 128.68,80.31 133.76,80.31 133.76,85.39
  pour Bottom (no thermals): 93.12,85.39 93.12,80.31 98.2,80.31 98.2,85.39
  pour Bottom (no thermals): 49.94,85.39 49.94,80.31 55.02,80.31 55.02,85.39
  pour Bottom (no thermals): 32.16,93.01 38.51,93.01 38.51,86.66 32.16,86.66
VBAT+
  pour Bottom (no thermals): 12.47,86.66 12.47,70.15 21.68,70.15 21.68,86.66

### Text on the board
tNames: + | - | 18V-48V | USE LOW ESR CERAMIC CAPACITORS FOR FILTERING | ARVP POWER SUPPLY | REV 1.1, 03/2017 | UWQ-12/20-T48NTB-C | UWE-5/20-Q48NB-C | UWE-5/20-Q48NB-C | AVOID USING | MORE CAPACITANCE | MAXIMUM AMOUNT | V_BAT | + | THAN REQUIRED | FOR NOISE/RIPPLE | OF CAPACITANCE | - | FILTERING | PER RAIL: 4700uF | V_BAT OK | A. SCHROEDER | A. LETOURNEAU | SENSE | 3V3 | 5V | 12V | GND | 3V3 | 5V | 12V | SUPPLY | USE SOLDER FLUX WHEN | GND | SOLDERING INTO WIRE PADS! | 12V (MAX: 240W) | 5V (MAX: 100W) | 3V3 (MAX: 100W) | TO SWITCH OFF | CONVERTERS, | SHORT ON/OFF | BATT_GND | 3V3 ON/OFF | 5V ON/OFF | 12V ON/OFF | TO BATT_GND